# Altium schematic sheet BlockDiagram.SchDoc
size A3; SheetNumber: 2; SheetTotal: 5
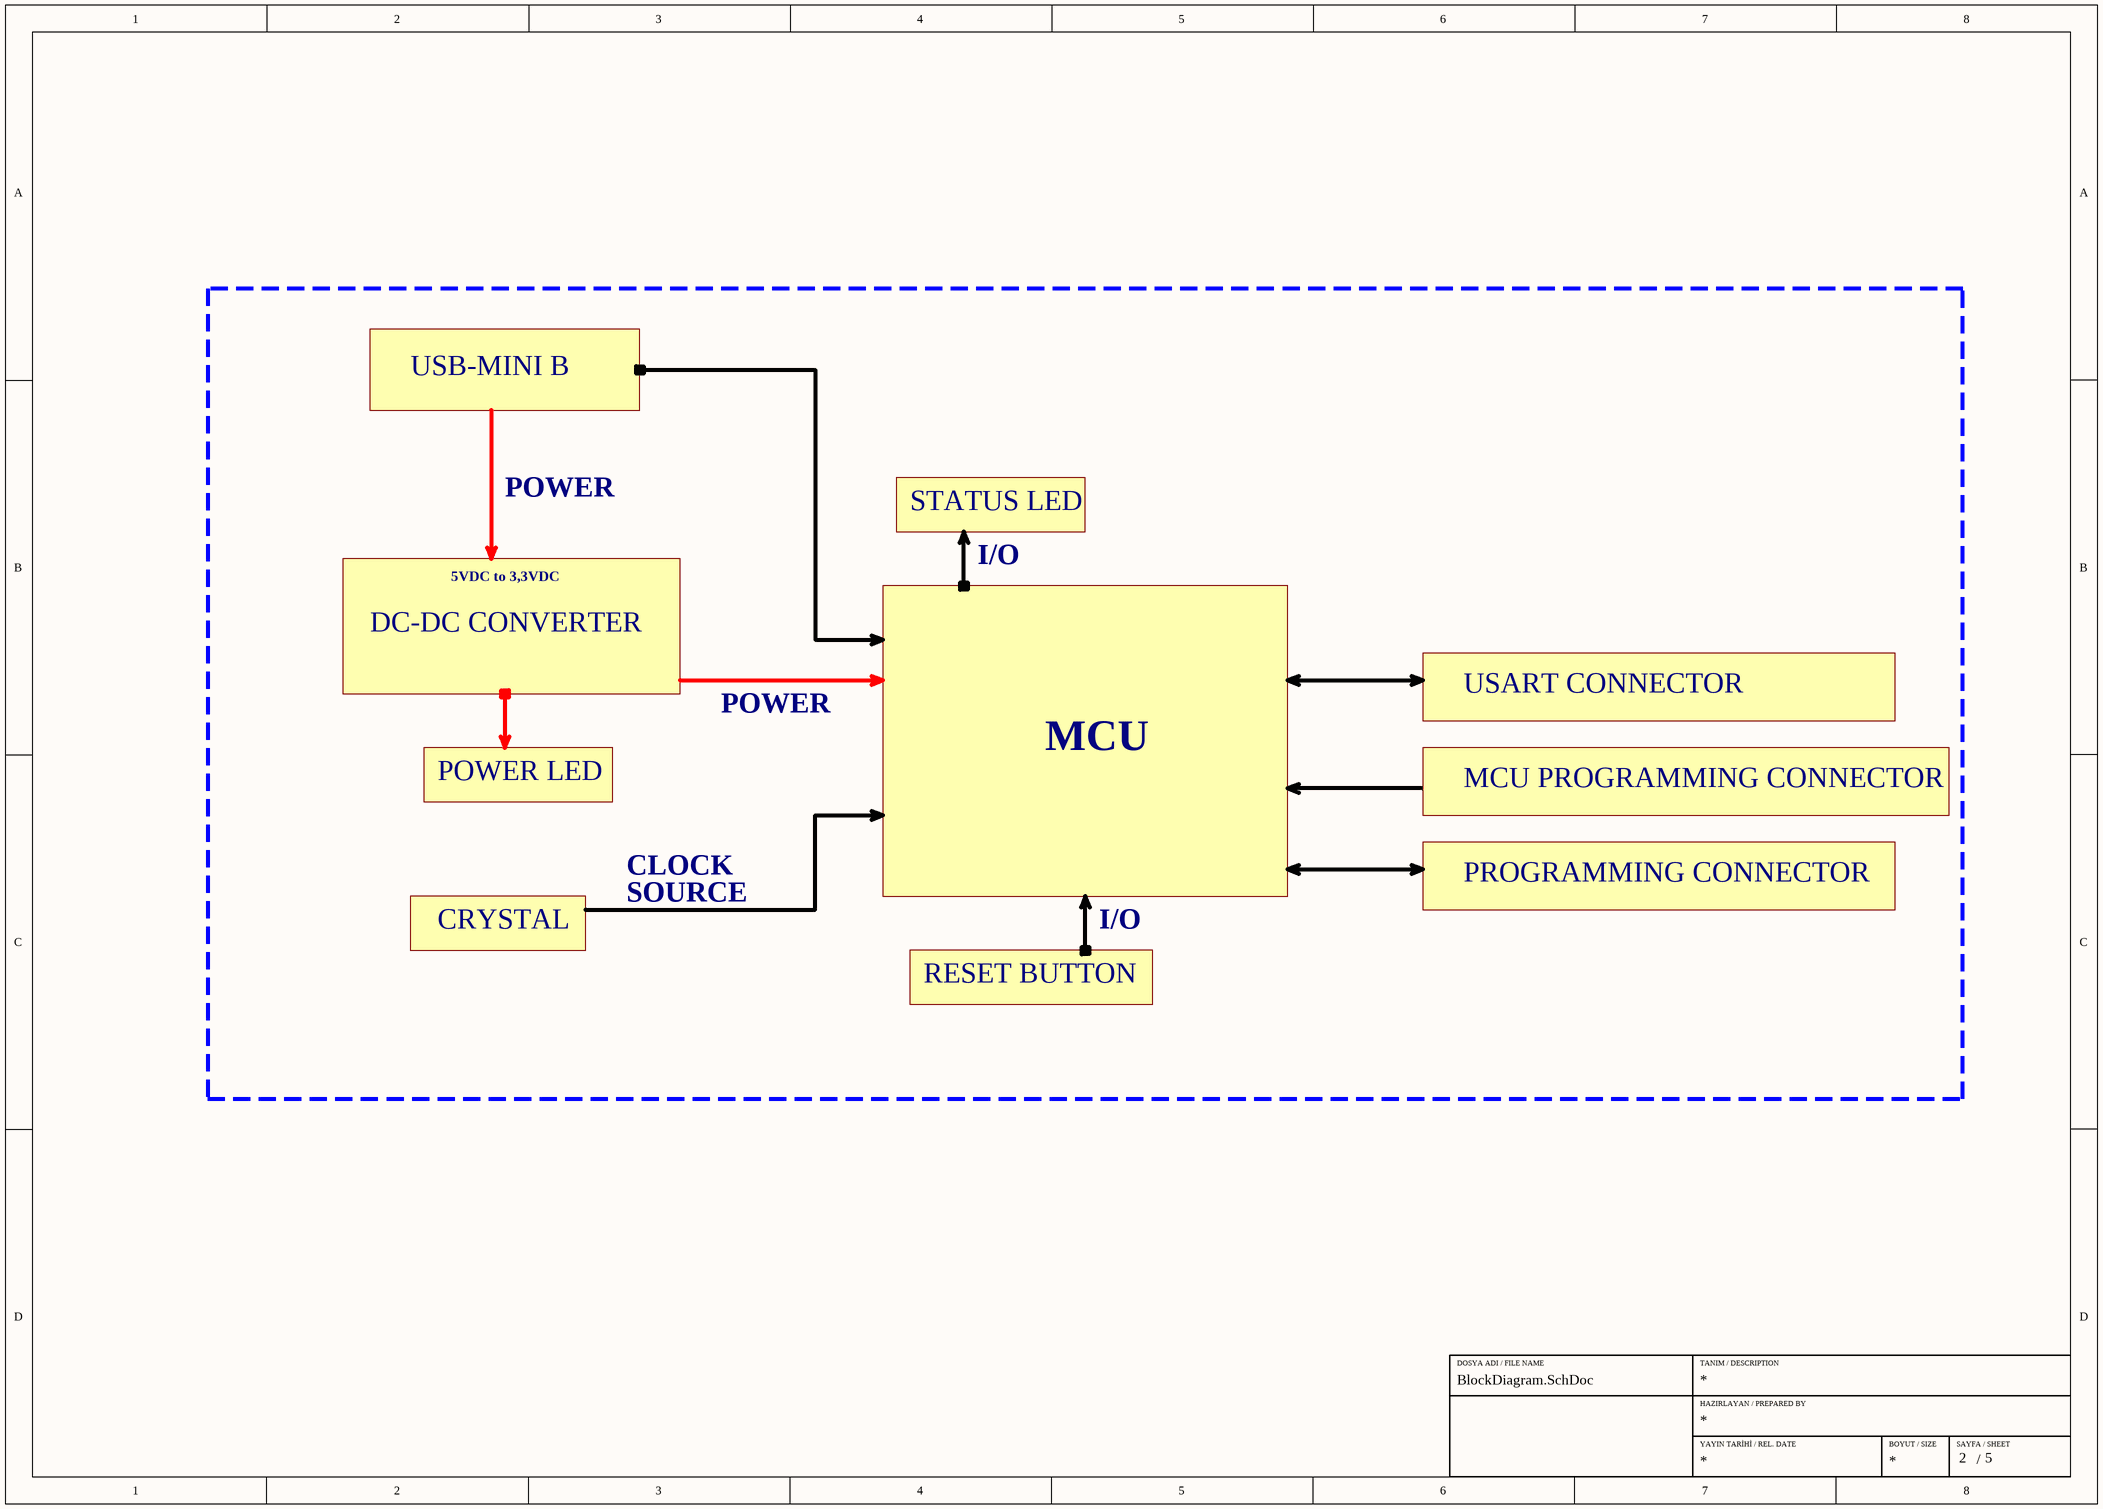
[diagram p0: BlockDiagram.SchDoc]

## Notes on the sheet
- USB-MINI B
- POWER
- STATUS LED
- 5VDC to 3,3VDC
- I/O
- DC-DC CONVERTER
- USART CONNECTOR
- POWER LED
- MCU
- MCU PROGRAMMING CONNECTOR
- CLOCK
- SOURCE
- PROGRAMMING CONNECTOR
- CRYSTAL
- RESET BUTTON
- DOSYA ADI / FILE NAME
- TANIM / DESCRIPTION
- HAZIRLAYAN / PREPARED BY
- YAYIN TARİHİ / REL. DATE
- BOYUT / SIZE
- SAYFA / SHEET
- /